# Altium schematic sheet USB.SchDoc
size A4
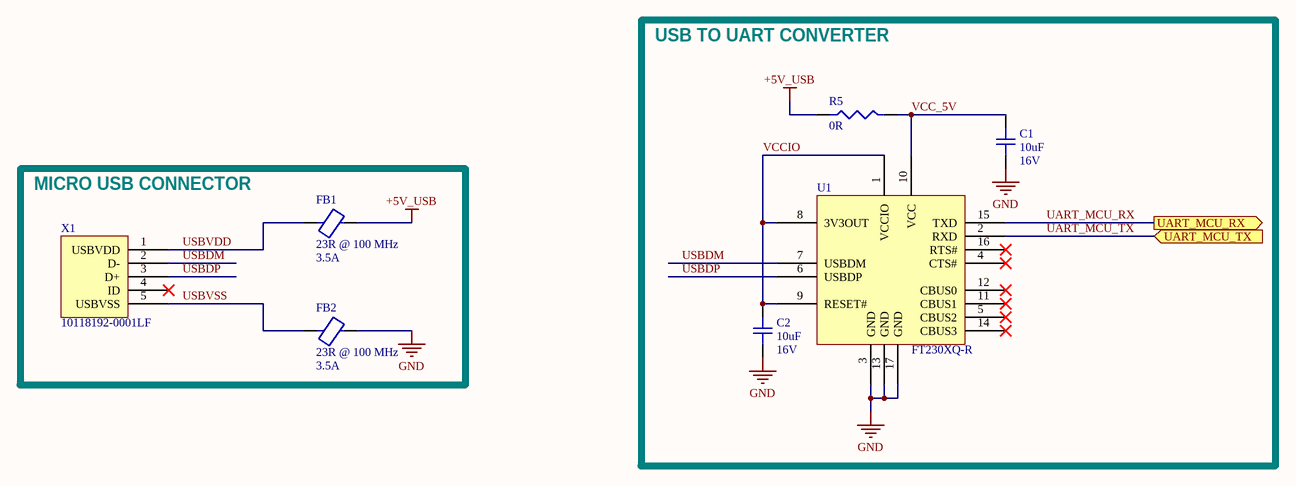
[diagram p0: USB.SchDoc]

## Parts
C1  10uF  Voltage Rating: 16V  [C0805]
C2  10uF  Voltage Rating: 16V  [C0805]
FB1  23R @ 100 MHz  Max Current Rating: 3.5A  [FB_1806]
FB2  23R @ 100 MHz  Max Current Rating: 3.5A  [FB_1806]
R5  0R  [R0402]
U1  FT230XQ-R  [QFN_EP-16]
X1  10118192-0001LF  [USB_MICRO]

## Blocks framed on the sheet
USB TO UART CONVERTER: C1 C2 R5 U1
MICRO USB CONNECTOR: FB1 FB2 X1

## Ports
UART_MCU_RX, UART_MCU_TX

## Nets
+5V_USB: FB1.2 R5.1
GND: C1.1 C2.1 FB2.2 U1.3(GND) U1.13(GND) U1.17(GND)
UART_MCU_RX: U1.15(TXD) ; port UART_MCU_RX
UART_MCU_TX: U1.2(RXD) ; port UART_MCU_TX
USBDM: U1.7(USBDM) X1.2(D-)
USBDP: U1.6(USBDP) X1.3(D+)
USBVDD: FB1.1 X1.1(USBVDD)
USBVSS: FB2.1 X1.5(USBVSS)
VCC_5V: C1.2 R5.2 U1.10(VCC)
VCCIO: C2.2 U1.1(VCCIO) U1.8(3V3OUT) U1.9(RESET#)

Not connected (* = marked no-connect by the designer): U1 4(CTS#)* 5(CBUS2)* 11(CBUS1)* 12(CBUS0)* 14(CBUS3)* 16(RTS#)*; X1 4(ID)*

## Library data of the parts
C1 C2 = CL21A106KOQNNNE: CAP CER 10uF 16V X5R 10% SMD 0805 85C T/R; Manufacturer: Samsung; Dielectric: X7R; Supplier 1: Digi-Key; Manufacturer Part Number: CL21A106KOQNNNE; Stock 1: 20000; Pricing 1: 1=0.21, 10=0.148, 100=0.0698, 500=0.0489, 1000=0.0405 (USD); Mount: Surface Mount; Case/Package: 0805; Case Code (Metric): 2012; Case Code (Imperial): 0805; Min Operating Temperature: -55°C; Max Operating Temperature: 85°C; Package Quantity: 1; Packaging: Tape and Reel; Capacitance: 10uF; Tolerance: 10%; Voltage Rating (DC): 16V; Voltage: 16V; Length: 2mm; Height: 1.25mm; Width: 0.049inch; Thickness: 0.055inch; Depth: 1.25mm; Radiation Hardening: No; Lead Free: Lead Free; ComponentLink1URL: https://datasheet.ciiva.com/25798/cl21a106koqnnne-25798133.pdf; ComponentLink1Description: https://datasheet.ciiva.com/25798/cl21a106koqnnne-25798133.pdf; ComponentLink2URL: https://datasheet.ciiva.com/16740/cl05b104kq5nnnc-16740697.pdf; ComponentLink2Description: https://datasheet.ciiva.com/16740/cl05b104kq5nnnc-16740697.pdf; ComponentLink3URL: https://datasheet.ciiva.com/15216/getdatasheetpartid-358435-15216234.pdf; ComponentLink3Description: https://datasheet.ciiva.com/15216/getdatasheetpartid-358435-15216234.pdf; Supplier Part Number 1: 1276-1096-1-ND
FB1 FB2 = FBMJ4516HL230NTV: FERRITE BEAD Ind Chip Bead Multi-Layer 23Ohm 30% 100MHz Ferrite 3.5A 1806 T/R; Manufacturer: Taiyo Yuden; Resistance: 180623R; Number of Lines: 1; DC Resistance (DCR): 14mR; Supplier 1: Digi-Key; Manufacturer Part Number: FBMJ4516HL230NTV; Stock 1: 1819; Pricing 1: 1=0.26, 10=0.202, 25=0.1676, 50=0.1444, 100=0.1299, 250=0.1097, 500=0.0982, 1000=0.0837 (USD); Mount: Surface Mount; Case/Package: 1806; Core Material: Ferrite; Case Code (Metric): 4516; Case Code (Imperial): 1806; Min Operating Temperature: -40°C; Max Operating Temperature: 125°C; Tolerance: 30%; Impedance: 23R; Package Quantity: 2000; Packaging: Tape and Reel; Max DC Current: 3.5A; Termination: SMD/SMT; Test Frequency: 100MHz; Length: 0.177inch; Height: 1.1mm; Width: 1.6mm; Depth: 1.6mm; ComponentLink1URL: http://www.mouser.com/ds/2/396/chipbeads01_e-559265.pdf; ComponentLink1Description: http://www.mouser.com/ds/2/396/chipbeads01_e-559265.pdf; ComponentLink2URL: http://ds.yuden.co.jp/TYCOMPAS/ut/detail.do?productNo=FBMJ4516HL230NTV&fileName=FBMJ4516HL230NTV_SS&mode=specSheetDownload; ComponentLink2Description: http://ds.yuden.co.jp/TYCOMPAS/ut/detail.do?productNo=FBMJ4516HL230NTV&fileName=FBMJ4516HL230NTV_SS&mode=specSheetDownload; ComponentLink3URL: https://www.yuden.co.jp/ut/product/category/emisuppression/FBMJ4516HL230NTV_SS.pdf; ComponentLink3Description: https://www.yuden.co.jp/ut/product/category/emisuppression/FBMJ4516HL230NTV_SS.pdf; Supplier Part Number 1: 587-3857-1-ND
R5 = RC0402JR-070RL: RES SMD 0 OHM 1/16W 0402; Manufacturer: Yageo; Resistance: 0mR; Power Rating: 62.5mW; Tolerance: 5%; Voltage Rating: 50V; Max Power Dissipation: 63mW; Temperature Coefficient: 200ppm/°C; Supplier 1: Digi-Key; Manufacturer Part Number: RC0402JR-070RL; Stock 1: 44333412; Pricing 1: 1=0.1, 10=0.017, 25=0.0124, 50=0.0096, 100=0.007, 250=0.0054, 500=0.0043, 1000=0.0032, 5000=0.0023 (USD); Case/Package: 0402; Contact Plating: Matte,Tin; Case Code (Metric): 1005; Case Code (Imperial): 0402; Min Operating Temperature: -55°C; Max Operating Temperature: 155°C; Packaging: Tape and Reel; Composition: Thick Film; Package Quantity: 1; Number of Terminations: 2; Termination: SMD/SMT; Military Standard: Not; Features: Moisture Resistant; Length: 1mm; Height: 0.016inch; Width: 0.02inch; Depth: 0.5mm; Radiation Hardening: No; REACH SVHC: Unknown; Lead Free: Lead Free; Supplier Part Number 1: 311-0.0JRCT-ND
U1 = FT230XQ-R: IC USB SERIAL BASIC UART 16QFN; Manufacturer: FTDI; Operating Supply Voltage: 5V; Data Rate: 12Mbps; Number of Channels: 1; Max Supply Voltage: 5.5V; Min Supply Voltage: 2.97V; Interface: USB,UART; Operating Supply Current: 8mA; Supplier 1: Digi-Key; Manufacturer Part Number: FT230XQ-R; Stock 1: 185744; Pricing 1: 1=2.04, 25=1.97, 100=1.9, 250=1.71, 500=1.54, 1000=1.4806 (USD); Mount: Surface Mount; Case/Package: QFN; Number of Pins: 16; Weight: 0.002014oz; Min Operating Temperature: -40°C; Max Operating Temperature: 85°C; Packaging: Tape and Reel; Package Quantity: 5000; Length: 4mm; Height: 0.75mm; Width: 4mm; Lead Free: Lead Free; ComponentLink1URL: https://datasheet.ciiva.com/16213/ds-ft230x-16213755.pdf; ComponentLink1Description: https://datasheet.ciiva.com/16213/ds-ft230x-16213755.pdf; ComponentLink2URL: https://datasheet.ciiva.com/48909/70403914-48909084.pdf; ComponentLink2Description: https://datasheet.ciiva.com/48909/70403914-48909084.pdf; ComponentLink3URL: https://datasheet.ciiva.com/1787/ft-x-series-1787309.pdf; ComponentLink3Description: https://datasheet.ciiva.com/1787/ft-x-series-1787309.pdf; ComponentLink4URL: https://datasheet.ciiva.com/1787/ft-x-series-1787310.pdf; ComponentLink4Description: https://datasheet.ciiva.com/1787/ft-x-series-1787310.pdf; ComponentLink5URL: https://datasheet.ciiva.com/1787/ft-x-series-1787311.pdf; ComponentLink5Description: https://datasheet.ciiva.com/1787/ft-x-series-1787311.pdf; ComponentLink6URL: https://datasheet.ciiva.com/30478/0900766b811020cb-30478159.pdf; ComponentLink6Description: https://datasheet.ciiva.com/30478/0900766b811020cb-30478159.pdf; Supplier Part Number 1: 768-1130-1-ND
X1 = 10118192-0001LF: CONN_USB - micro B USB 2.0 Receptacle Connector 5 Position Surface Mount, Right Angle, Horizontal; Manufacturer: Amphenol FCI; Current Rating: 1.8A; Connector Type: USB,Receptacle; Number of Contacts: 5; Insulation Resistance: 1GR; Number of Ports: 1; Max Voltage Rating (AC): 100V; USB Standard: USB 2.0; Pitch: 0.65mm; Supplier 1: Digi-Key; Manufacturer Part Number: 10118192-0001LF; Stock 1: 197826; Pricing 1: 1=0.46, 10=0.437, 25=0.3744, 50=0.318, 100=0.3056, 250=0.2744, 500=0.262 (USD); Mount: Surface Mount,Horizontal; Contact Material: Copper Alloy; Contact Plating: Nickel,Gold; Number of Terminals: 5; Housing Material: Polymer; Colour: Black; Min Operating Temperature: -55°C; Max Operating Temperature: 85°C; Packaging: Tape and Reel; Package Quantity: 1400; Gender: Receptacle; Termination: Solder; Voltage Rating: 100V; Orientation: Right Angle; Length: 7.86mm; Depth: 5.57mm; Radiation Hardening: No; REACH SVHC: No SVHC; Lead Free: Lead Free; Flammability Rating: UL94 V-0; ComponentLink1URL: https://datasheet.ciiva.com/26853/getdatasheetpartid-418041-26853891.pdf; ComponentLink1Description: https://datasheet.ciiva.com/26853/getdatasheetpartid-418041-26853891.pdf; ComponentLink2URL: https://datasheet.ciiva.com/851/10118192-851112.pdf; ComponentLink2Description: https://datasheet.ciiva.com/851/10118192-851112.pdf; ComponentLink3URL: https://datasheet.ciiva.com/4598/10118192ac-197249-4598796.pdf; ComponentLink3Description: https://datasheet.ciiva.com/4598/10118192ac-197249-4598796.pdf; Supplier Part Number 1: 609-4613-1-ND